# EAGLE design OSSIBeacon (EAGLE 6.1)

## Sheet 1 of 2
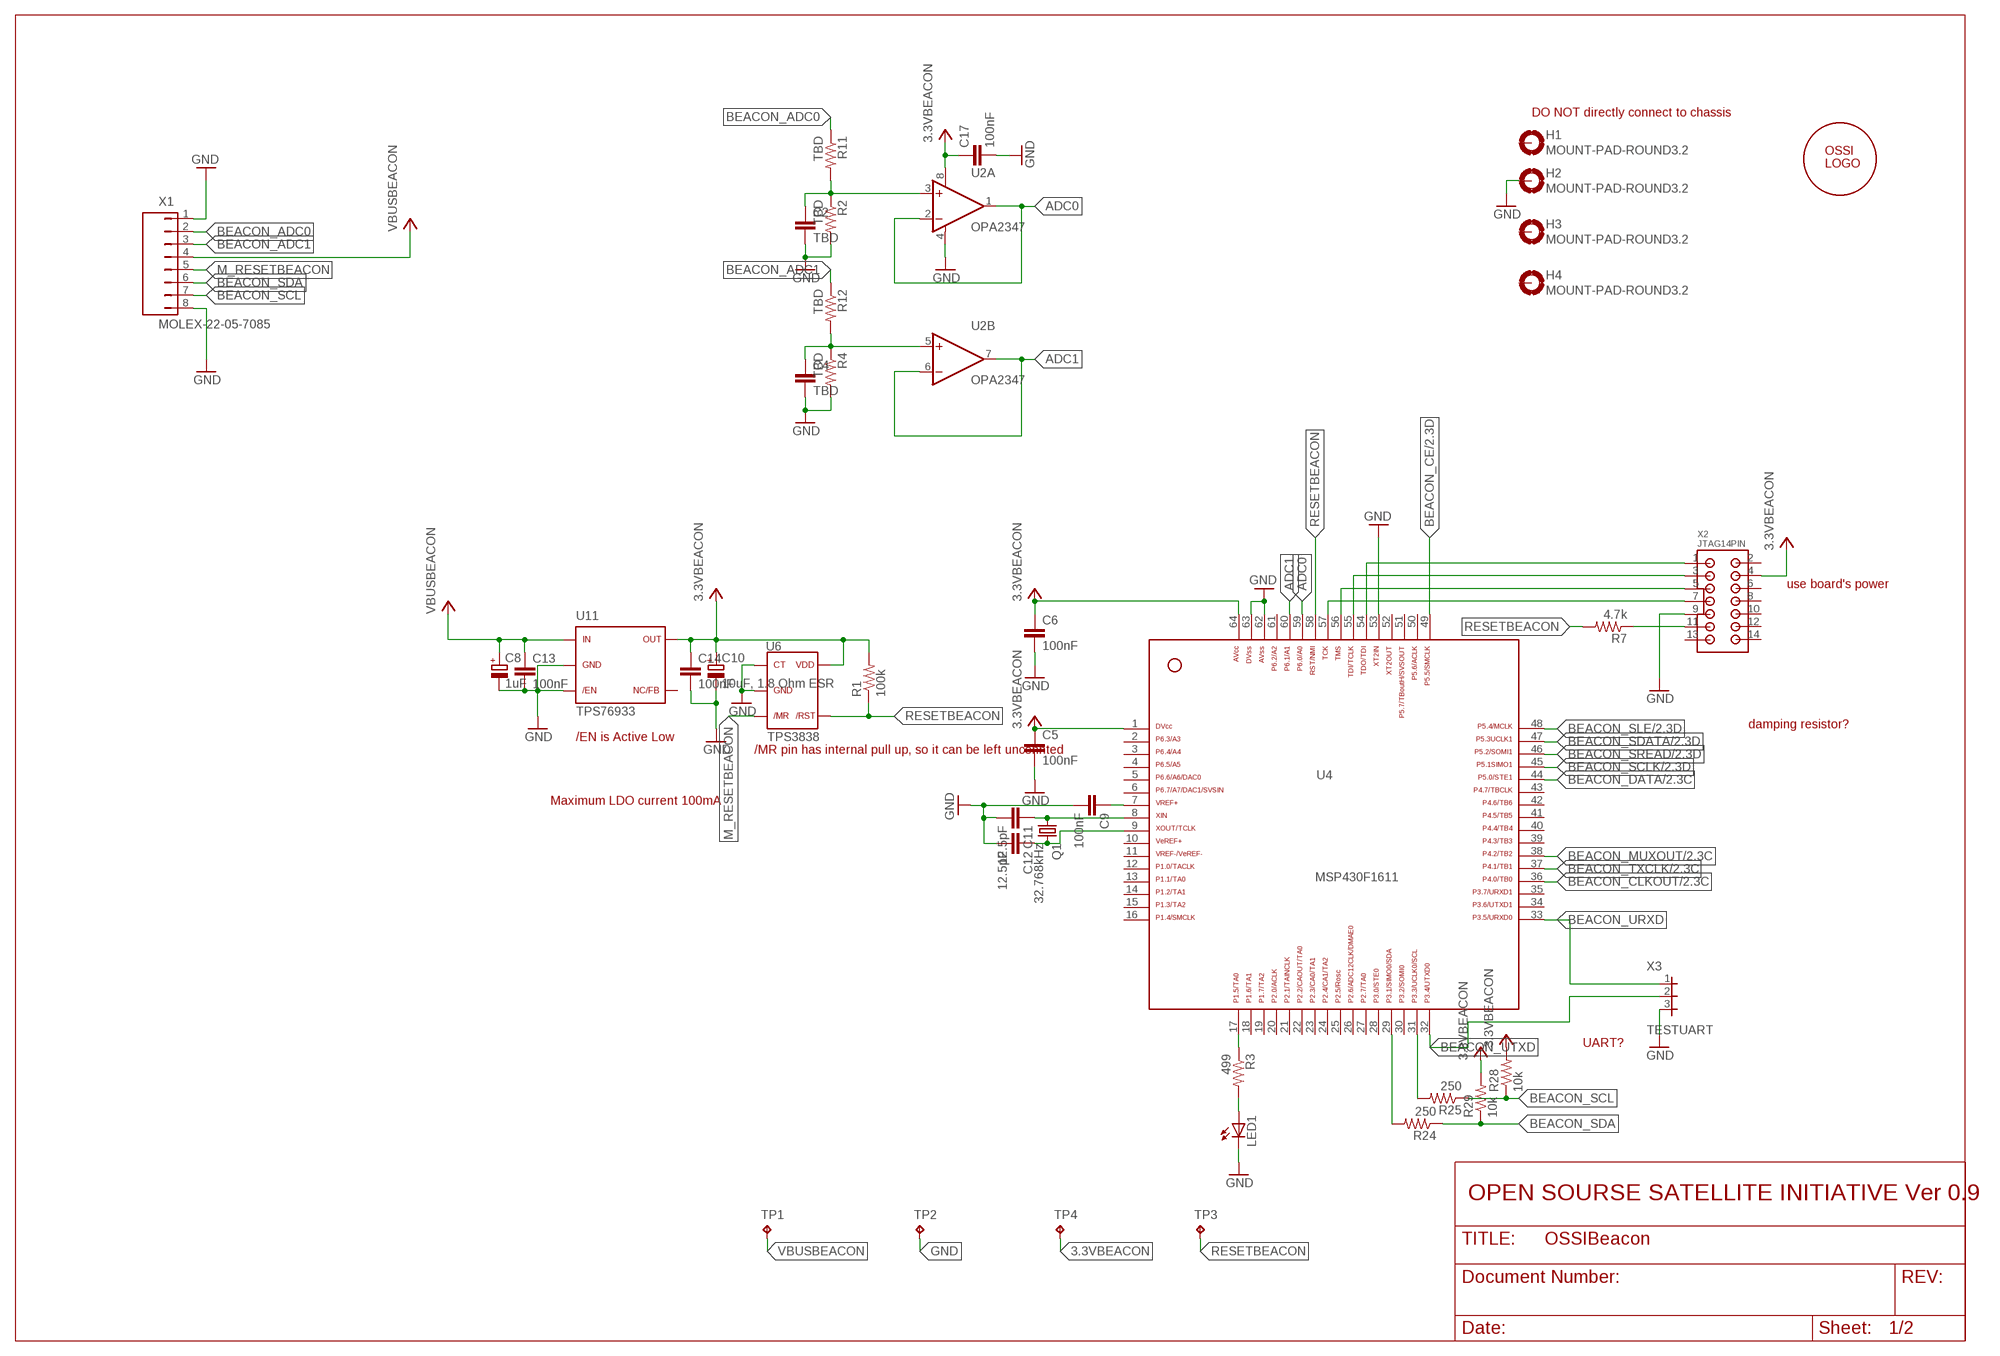
[diagram p0: schematic, sheet 1]

### Parts
C2  TBD  C0603(1608)  [C0603(1608)]
C4  TBD  C0603(1608)  [C0603(1608)]
C5  100nF  C0603(1608)  [C0603(1608)]
C6  100nF  C0603(1608)  [C0603(1608)]
C8  1uF  C-TANTAL-A  [C1206(3216)-A]
C9  100nF  C0603(1608)  [C0603(1608)]
C10  10uF, 1.8 Ohm ESR  C-TANTAL-C  [C2312(6032)-C]
C11  12.5pF  C0603(1608)  [C0603(1608)]
C12  12.5pF  C0603(1608)  [C0603(1608)]
C13  100nF  C0603(1608)  [C0603(1608)]
C14  100nF  C0603(1608)  [C0603(1608)]
C17  100nF  C0603(1608)  [C0603(1608)]
H1  MOUNT-PAD-ROUND3.2  [3.2-PAD-ROUND]
H2  MOUNT-PAD-ROUND3.2  [3.2-PAD-ROUND]
H3  MOUNT-PAD-ROUND3.2  [3.2-PAD-ROUND]
H4  MOUNT-PAD-ROUND3.2  [3.2-PAD-ROUND]
LED1  LED3MM  [LED3MM]
Q1  32.768kHz  NX-3215  [NX-3215]
R1  100k  R0603(1608)  [R0603(1608)]
R2  TBD  R0603(1608)  [R0603(1608)]
R3  499  R0603(1608)  [R0603(1608)]
R4  TBD  R0603(1608)  [R0603(1608)]
R7  4.7k  R0603(1608)  [R0603(1608)]
R11  TBD  R0603(1608)  [R0603(1608)]
R12  TBD  R0603(1608)  [R0603(1608)]
R24  250  R0603(1608)  [R0603(1608)]
R25  250  R0603(1608)  [R0603(1608)]
R28  10k  R0603(1608)  [R0603(1608)]
R29  10k  R0603(1608)  [R0603(1608)]
TP1  TP  [TP-13]
TP2  TP  [TP-13]
TP3  TP  [TP-13]
TP4  TP  [TP-13]
U2  OPA2347  [SOT23-8DCN]
U4  MSP430F1611  [PM/PAG64]
U6  TPS3838  [SOT23-5DBV]
U11  TPS76933  [SOT23-5DBV]
U$1  OSSILOGO-10  [OSSILOGO1010]
X1  MOLEX-22-05-7085  [22-05-7085]
X2  JTAG14PIN  [2514-6002UB]
X3  TESTUART  [TESTUART]

### Nets
3.3VBEACON: C5.1 C6.1 C10.1(+) C14.1 C17.1 R1.2 R28.2 R29.2 TP4.TP U2.8(A:V+) U4.1 U4.64 U6.5 U11.5 X2.4 ; also sheet 2
ADC0: U2.1(A:OUT) U2.2(A:-IN) U4.59
ADC1: U2.6(B:-IN) U2.7(B:OUT) U4.60
BEACON_ADC0: R11.1 X1.2
BEACON_ADC1: R12.1 X1.3
BEACON_CE: U4.49 ; also sheet 2
BEACON_CLKOUT: U4.36 ; also sheet 2
BEACON_DATA: U4.44 ; also sheet 2
BEACON_MUXOUT: U4.38 ; also sheet 2
BEACON_SCL: R25.1 R28.1 X1.7
BEACON_SCLK: U4.45 ; also sheet 2
BEACON_SDA: R24.1 R29.1 X1.6
BEACON_SDATA: U4.47 ; also sheet 2
BEACON_SLE: U4.48 ; also sheet 2
BEACON_SREAD: U4.46 ; also sheet 2
BEACON_TXCLK: U4.37 ; also sheet 2
BEACON_URXD: U4.33 X3.1
BEACON_UTXD: U4.32 X3.2
GND: C2.2 C4.2 C5.2 C6.2 C8.2(-) C9.2 C10.2(-) C11.2 C12.2 C13.2 C14.2 C17.2 H2.B3,2(MOUNT) LED1.K(C) R2.2 R4.2 TP2.TP U2.4(A:V-) U4.53 U4.62 U4.63 U6.1 U6.2 U11.2 U11.3 X1.1 X1.8 X2.9 X3.3 ; also sheet 2
M_RESETBEACON: U6.3 X1.5
N$1: LED1.A R3.2
N$2: R3.1 U4.17
N$3: C4.1 R4.1 R12.2 U2.5(B:+IN)
N$6: C2.1 R2.1 R11.2 U2.3(A:+IN)
N$7: C11.1 Q1.1 U4.8
N$8: C12.1 Q1.2 U4.9
N$11: U4.54 X2.1
N$12: C9.1 U4.7
N$14: U4.55 X2.3
N$15: U4.56 X2.5
N$16: U4.57 X2.7
N$21: R7.1 X2.11
N$58: R24.2 U4.29
N$59: R25.2 U4.31
RESETBEACON: R1.1 R7.2 TP3.TP U4.58 U6.4
VBUSBEACON: C8.1(+) C13.1 TP1.TP U11.1 X1.4
Unconnected: H1.B3,2(MOUNT) H3.B3,2(MOUNT) H4.B3,2(MOUNT) U4.2 U4.3 U4.4 U4.5 U4.6 U4.10 U4.11 U4.12 U4.13 U4.14 U4.15 U4.16 U4.18 U4.19 U4.20 U4.21 U4.22 U4.23 U4.24 U4.25 U4.26 U4.27 U4.28 U4.30 U4.34 U4.35 U4.39 U4.40 U4.41 U4.42 U4.43 U4.50 U4.51 U4.52 U4.61 U11.4 X2.2 X2.6 X2.8 X2.10 X2.12 X2.13 X2.14

### Notes on the sheet
- DO NOT directly connect to chassis
- use board's power
- damping resistor?
- /EN is Active Low
- /MR pin has internal pull up, so it can be left unconnted
- Maximum LDO current 100mA
- UART?
- OPEN SOURSE SATELLITE INITIATIVE Ver 0.9

## Sheet 2 of 2
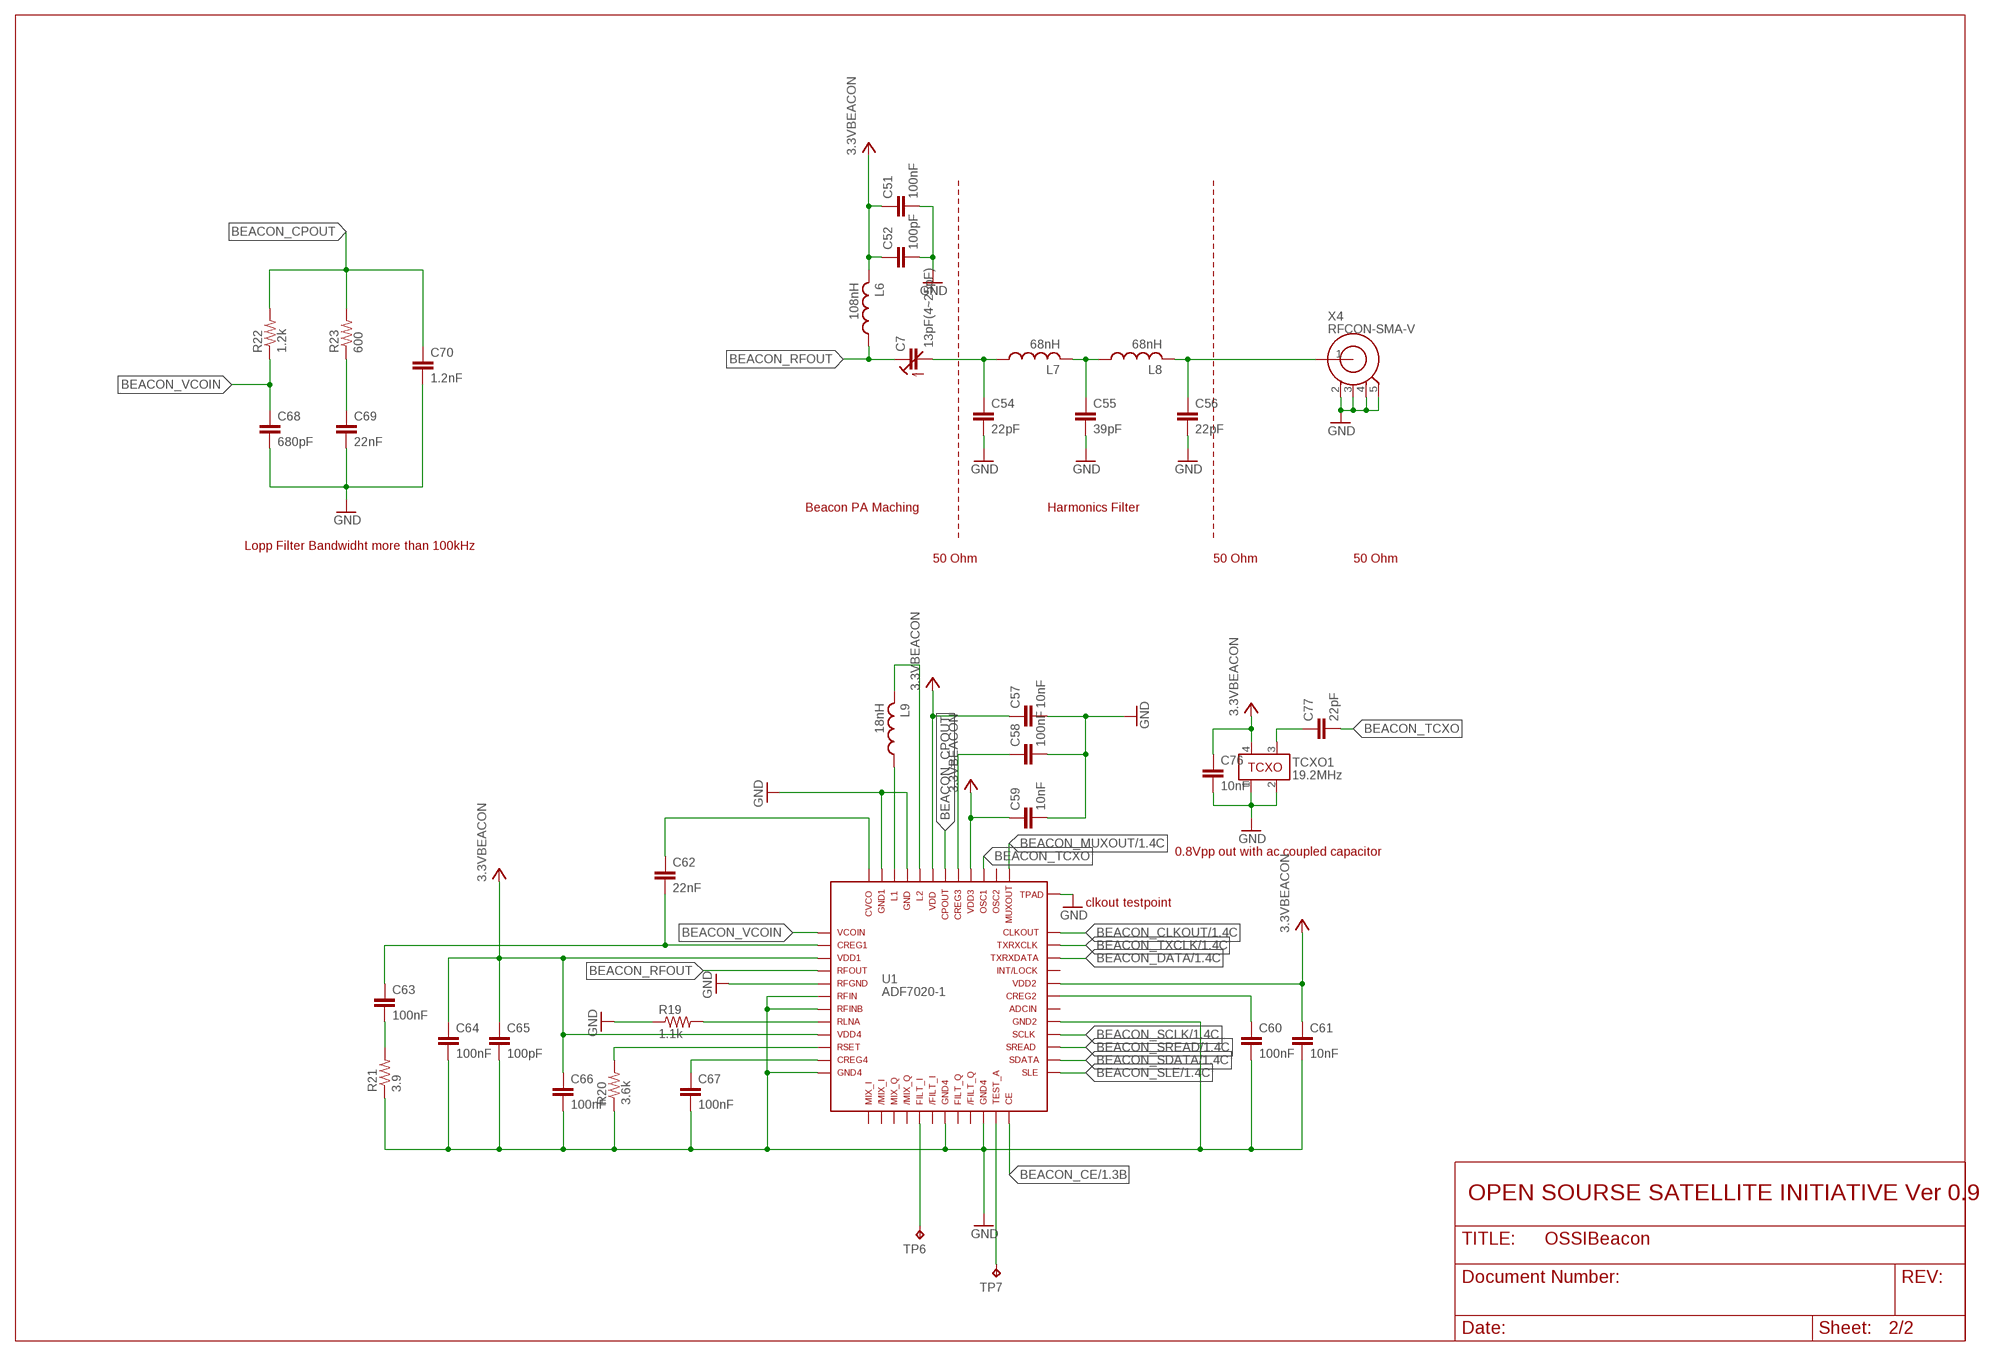
[diagram p1: schematic, sheet 2]

### Parts
C7  13pF(4~25pF)  C-TRIMM  [TZB4Z250BA10R00]
C51  100nF  C0603(1608)  [C0603(1608)]
C52  100pF  C0603(1608)  [C0603(1608)]
C54  22pF  C0603(1608)  [C0603(1608)]
C55  39pF  C0603(1608)  [C0603(1608)]
C56  22pF  C0603(1608)  [C0603(1608)]
C57  10nF  C0603(1608)  [C0603(1608)]
C58  100nF  C0603(1608)  [C0603(1608)]
C59  10nF  C0603(1608)  [C0603(1608)]
C60  100nF  C0603(1608)  [C0603(1608)]
C61  10nF  C0603(1608)  [C0603(1608)]
C62  22nF  C0603(1608)  [C0603(1608)]
C63  100nF  C0603(1608)  [C0603(1608)]
C64  100nF  C0603(1608)  [C0603(1608)]
C65  100pF  C0603(1608)  [C0603(1608)]
C66  100nF  C0603(1608)  [C0603(1608)]
C67  100nF  C0603(1608)  [C0603(1608)]
C68  680pF  C0603(1608)  [C0603(1608)]
C69  22nF  C0603(1608)  [C0603(1608)]
C70  1.2nF  C0603(1608)  [C0603(1608)]
C76  10nF  C0603(1608)  [C0603(1608)]
C77  22pF  C0603(1608)  [C0603(1608)]
L6  108nH  L0603(1608)  [L0603(1608)]
L7  68nH  L0603(1608)  [L0603(1608)]
L8  68nH  L0603(1608)  [L0603(1608)]
L9  18nH  L0603(1608)  [L0603(1608)]
R19  1.1k  R0603(1608)  [R0603(1608)]
R20  3.6k  R0603(1608)  [R0603(1608)]
R21  3.9  R0603(1608)  [R0603(1608)]
R22  1.2k  R0603(1608)  [R0603(1608)]
R23  600  R0603(1608)  [R0603(1608)]
TCXO1  19.2MHz  TCXO-M532  [TCXO_M532]
TP6  TP  [TP-13]
TP7  TP  [TP-13]
U1  ADF7020-1  [LFCSP48]
X4  RFCON-SMA-V  [SMA-V]

### Nets
3.3VBEACON: C51.1 C52.1 C57.1 C59.1 C61.1 C64.1 C65.1 C66.1 C76.1 L6.2 TCXO1.4 U1.3 U1.9 U1.32 U1.40 U1.43 ; also sheet 1
BEACON_CE: U1.24 ; also sheet 1
BEACON_CLKOUT: U1.36 ; also sheet 1
BEACON_CPOUT: C70.1 R22.2 R23.2 U1.42
BEACON_DATA: U1.34 ; also sheet 1
BEACON_MUXOUT: U1.37 ; also sheet 1
BEACON_RFOUT: C7.+(E) L6.1 U1.4
BEACON_SCLK: U1.28 ; also sheet 1
BEACON_SDATA: U1.26 ; also sheet 1
BEACON_SLE: U1.25 ; also sheet 1
BEACON_SREAD: U1.27 ; also sheet 1
BEACON_TCXO: C77.2 U1.39
BEACON_TXCLK: U1.35 ; also sheet 1
BEACON_VCOIN: C68.1 R22.1 U1.1
GND: C51.2 C52.2 C54.2 C55.2 C56.2 C57.2 C58.2 C59.2 C60.2 C61.2 C64.2 C65.2 C66.2 C67.2 C68.2 C69.2 C70.2 C76.2 R19.1 R20.1 R21.1 TCXO1.1 TCXO1.2 U1.5 U1.6 U1.7 U1.12 U1.19 U1.22 U1.29 U1.45 U1.47 U1.EXP X4.2 X4.3 X4.4 X4.5 ; also sheet 1
N$19: TP6.TP U1.17
N$23: TP7.TP U1.23
N$42: C7.-(A) C54.1 L7.1
N$43: C55.1 L7.2 L8.1
N$44: C56.1 L8.2 X4.1
N$45: C62.1 U1.48
N$46: C63.2 R21.2
N$47: C60.1 U1.31
N$48: C67.1 U1.11
N$49: R20.2 U1.10
N$50: R19.2 U1.8
N$51: C58.1 U1.41
N$52: C62.2 C63.1 U1.2
N$53: C69.1 R23.1
N$54: L9.1 U1.46
N$55: L9.2 U1.44
N$69: C77.1 TCXO1.3
Unconnected: U1.13 U1.14 U1.15 U1.16 U1.18 U1.20 U1.21 U1.30 U1.33 U1.38

### Notes on the sheet
- Beacon PA Maching | Harmonics Filter
- Lopp Filter Bandwidht more than 100kHz
- 50 Ohm | 50 Ohm | 50 Ohm
- 0.8Vpp out with ac coupled capacitor
- clkout testpoint
- OPEN SOURSE SATELLITE INITIATIVE Ver 0.9

## Library data of the parts
C2 C4-C6 C9 C11-C14 C17 C51 C52 C54-C70 C76 C77 = OSSI:C
C7 = OSSI:C-TRIMM
C8 = OSSI:C-TANTAL-A: TAJA105M020RNJ Tantal Capacitor Manufacturer: AVX 1206(3126) Ref: www.avx.com/docs/techinfo/tantappl.pdf
C10 = OSSI:C-TANTAL-C: THJC106M025RJN Taltal Capacitor manufacture: AVX 2312(6032)
H1-H4 = OSSI:MOUNT-PAD-ROUND
L6-L9 = OSSI:L
LED1 = led:LED: LED OSRAM: - CHIPLED LG R971, LG N971, LY N971, LG Q971, LY Q971, LO R971, LY R971 LH N974, LH R974 LS Q976, LO Q976, LY Q976 LO Q996 - Hyper CHIPLED LW Q18S LB Q993, LB Q99A, LB R99A - SideLED LS A670, LO A670, LY A670, LG A670, LP A670 LB A673, LV A673, LT A673, LW A673 LH A674 LY A675 LS A676, LA A676, LO A676, LY A676, LW A676 LS A679, LY A679, LG A679 - Hyper Micro SIDELED® LS Y876, LA Y876, LO Y876, LY Y876 LT Y87S - SmartLED LW L88C, LW L88S LB L89C, LB L89S, LG L890 LS L89K, LO L89K, LY L89K LS L896, LA L896, LO L896, LY L896 - TOPLED LS T670, LO T670, LY T670, LG T670, LP T670 LSG T670, LSP T670, LSY T670, LOP T670, LYG T670 LG T671, LOG T671, LSG T671 LB T673, LV T673, LT T673, LW T673 LH T674 LS T676, LA T676, LO T676, LY T676, LB T676, LH T676, LSB T676, LW T676 LB T67C, LV T67C, LT T67C, LS T67K, LO T67K, LY T67K, LW E67C LS E67B, LA E67B, LO E67B, LY E67B, LB E67C, LV E67C, LT E67C LW T67C LS T679, LY T679, LG T679 LS T770, LO T770, LY T770, LG T770, LP T770 LB T773, LV T773, LT T773, LW T773 LH T774 LS E675, LA E675, LY E675, LS T675 LS T776, LA T776, LO T776, LY T776, LB T776 LHGB T686 LT T68C, LB T68C - Hyper Mini TOPLED® LB M676 - Mini TOPLED Santana® LG M470 LS M47K, LO M47K, LY M47K Source: http://www.osram.convergy.de LUXEON: - LUMILED® LXK2-PW12-R00, LXK2-PW12-S00, LXK2-PW14-U00, LXK2-PW14-V00 LXK2-PM12-R00, LXK2-PM12-S00, LXK2-PM14-U00 LXK2-PE12-Q00, LXK2-PE12-R00, LXK2-PE12-S00, LXK2-PE14-T00, LXK2-PE14-U00 LXK2-PB12-K00, LXK2-PB12-L00, LXK2-PB12-M00, LXK2-PB14-N00, LXK2-PB14-P00, LXK2-PB14-Q00 LXK2-PR12-L00, LXK2-PR12-M00, LXK2-PR14-Q00, LXK2-PR14-R00 LXK2-PD12-Q00, LXK2-PD12-R00, LXK2-PD12-S00 LXK2-PH12-R00, LXK2-PH12-S00 LXK2-PL12-P00, LXK2-PL12-Q00, LXK2-PL12-R00 Source: www.luxeon.com KINGBRIGHT: KA-3528ASYC Source: www.kingbright.com
Q1 = OSSI:NX-3215: NDK 32.768 kHz SMD Crystal P/N: NX3215SA-32.768K-STD-MUA-9 Nominal frequency (kHz): 32.768 Package Size (L×W×H : mm): 3.2×1.5×0.8 Operating Temperature Range(*1) / Storage Temperature Range (°C): -40 to +85 / -40 to +85 Level of drive: 0.1µW (Max. 0.5µW) Frequency Tolerance (25±3°C): ±20×10-6 Load Capacitance: 9.0pF, 12.5pF Equivalent Series Resistance: 70kΩ Max. Ordering Code: NX3215SA-32.768K-STD-MUA-9 (Load Capacitance9.0pF) /NX3215SA-32.768K-STD-MUA-8 (Load Capacitance12.5pF)
R1-R4 R7 R11 R12 R19-R25 R28 R29 = OSSI:R
TCXO1 = OSSI:TCXO-M532: 532L25DT19M2000: CTO electronic components Model 532 19.2MHz TCXO for RF transeiver Clipped Sine Wave Output Operating Voltage, +3.3Vdc Operating Temperature to -30°C to +85°C Frequency Stability: ±2.5ppm
TP1-TP4 TP6 TP7 = OSSI:TP
U1 = OSSI:ADF7020-1: ADF7020-1 RF transceiver by analog device
U2 = OSSI:OPA2347: OPA2347 RAIL-TO-RAIL INPUT AND OUTPUT SINGLE SUPPLY: 2.3V to 5.5V LOW IQ: 20µ
U4 = OSSI:MSP430F1611: MSP430F1611
U6 = OSSI:TPS3838: TPS3838 NanoPower Supervisory IC from texas instruments. TPS3838 is open-drain output
U11 = OSSI:TPS769*: TPS769XX series LDO 100mA / 70mV drop out
U$1 = OSSI:OSSILOGO
X1 = OSSI:MOLEX-22-05-7085
X2 = OSSI:JTAG14PIN: JTAG 14 Pin Connector
X3 = OSSI:TESTUART
X4 = OSSI:RFCON: RF Connectors

## Board
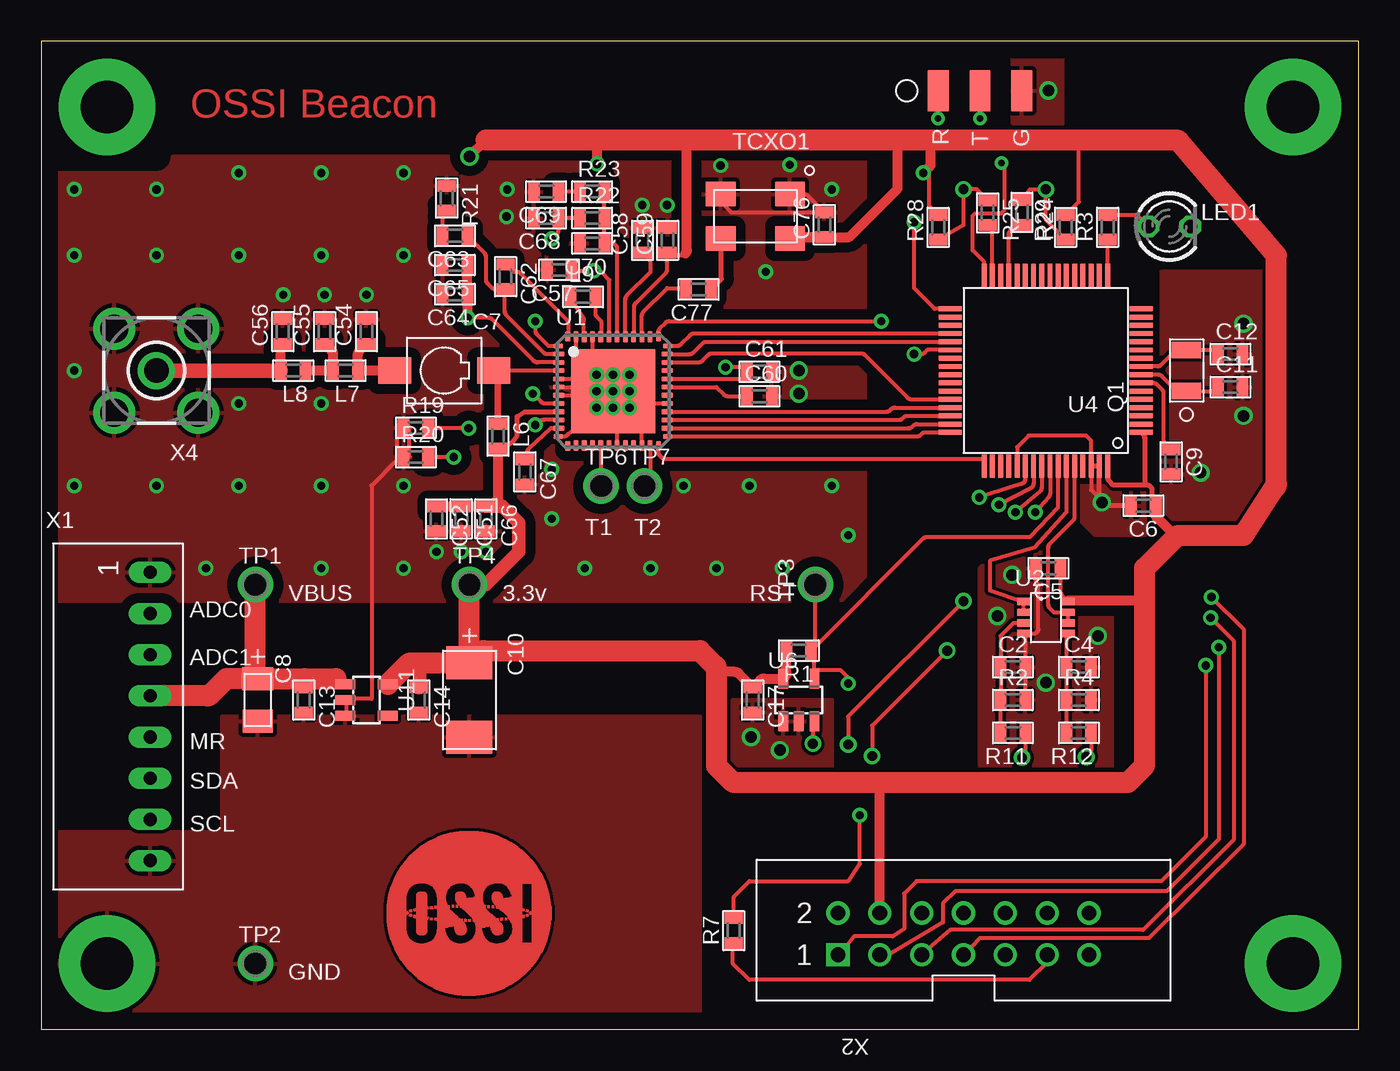
[diagram p2: board, top side]
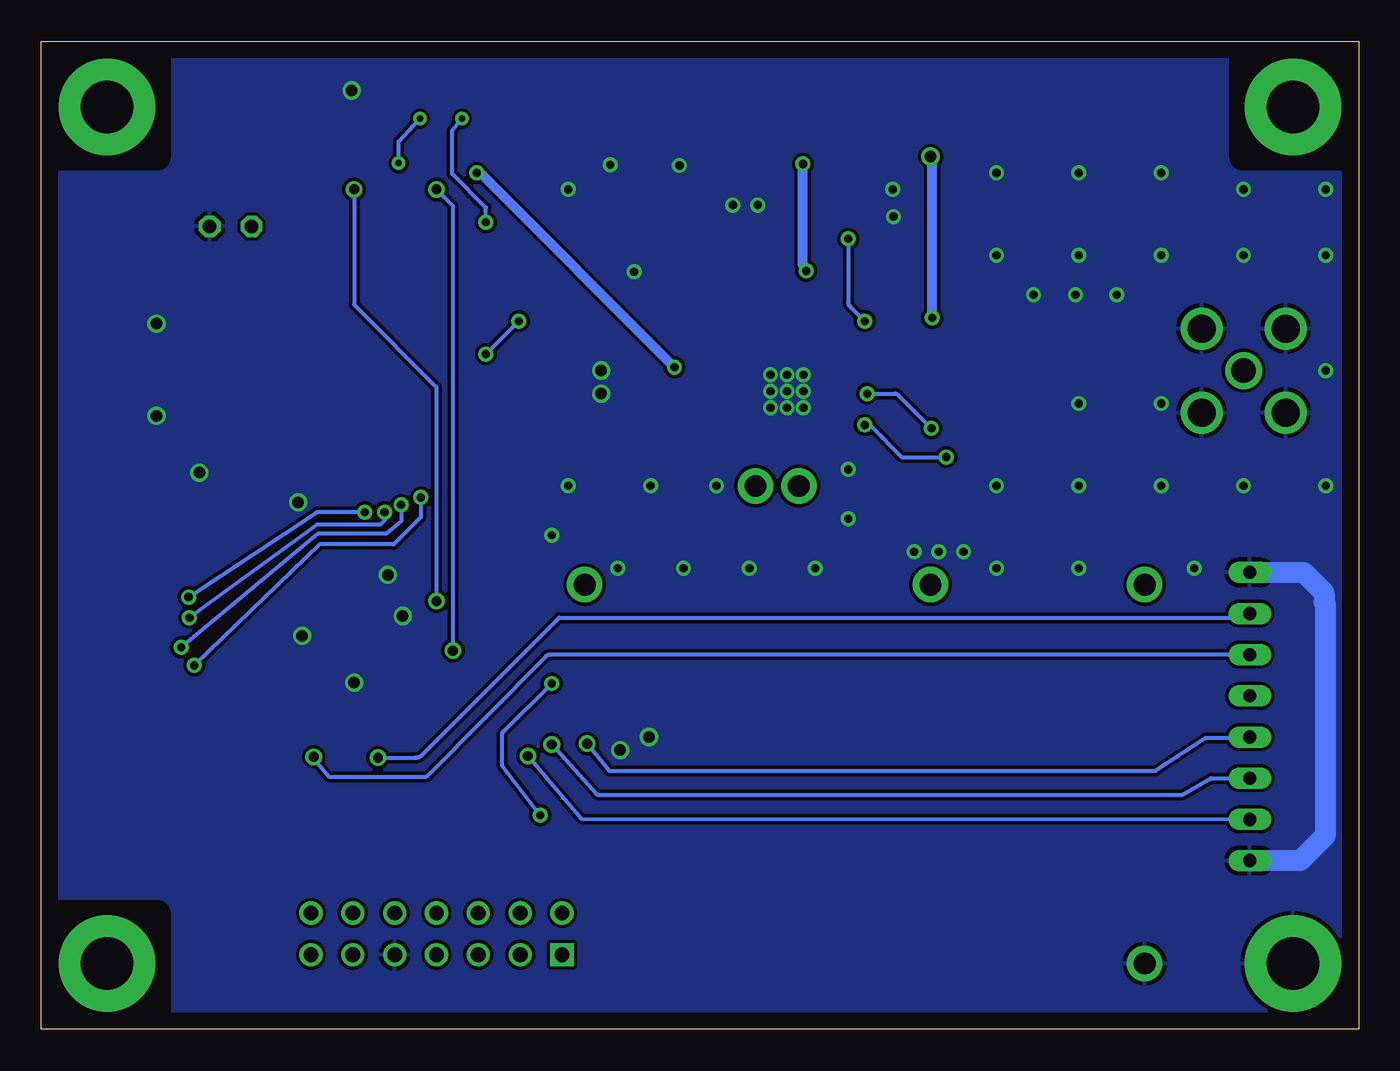
[diagram p3: board, bottom side, seen from below]

Size 80 x 60 mm. Coordinates in mm from the lower left corner, seen from the top.
Outline: 0,60 0,0 80,0 80,60 0,60
Copper layers (1*16): Top 0.035mm / dielectric 1.5mm / Bottom 0.035mm
Design rules: minimum track width 10mil, minimum drill 15mil, track to track 8mil, track to pad 6mil, pad to pad 6mil, via to via 6mil, smd to smd 6mil, copper to edge 40mil, drill to drill 8mil, minimum pad ring 10mil, minimum via ring 8mil, stop-mask expansion 4mil, vias tented up to drill 0mil, thermal gap 10mil

### Footprints (pad centres in the part's own frame; a part is rotated, then mirrored left to right if it is on the bottom)
C0603(1608) = smd 0.7 x 1.1: 1 -0.75,0; 2 0.75,0
TZB4Z250BA10R00 = smd 2 x 1.6: + -3,0; - 3,0
C1206(3216)-A = smd 1.4 x 1.9: 1 -1.3,0 | smd 1.4 x 1.8: 2 1.3,0
C2312(6032)-C = smd 2 x 2.8: 1 -2.25,0; 2 2.25,0
3.2-PAD-ROUND = drill 3.2 pad 5.842: B3,2 0,0
L0603(1608) = smd 0.7 x 1.1: 1 -0.75,0; 2 0.75,0
LED3MM = drill 0.813 octagon: A -1.27,0; K 1.27,0
NX-3215 = smd 1 x 1.8: 1 -1.25,0; 2 1.25,0
R0603(1608) = smd 0.7 x 1.1: 1 -0.75,0; 2 0.75,0
TCXO_M532 = smd 1.8 x 1.5: 1 -2.1,-1.35; 2 2.1,-1.35; 3 2.1,1.35; 4 -2.1,1.35
TP-13 = drill 1.321 pad 2.159: TP 0,0
LFCSP48 = smd 0.6 x 0.32: 1 -3.325,2.75; 12 -3.325,-2.75; 25 3.325,-2.75; 36 3.325,2.75 | smd 0.7 x 0.32: 2 -3.3,2.25; 3 -3.3,1.75; 4 -3.3,1.25; 5 -3.3,0.75; 6 -3.3,0.25; 7 -3.3,-0.25; 8 -3.3,-0.75; 9 -3.3,-1.25; 10 -3.3,-1.75; 11 -3.3,-2.25; 26 3.3,-2.25; 27 3.3,-1.75; 28 3.3,-1.25; 29 3.3,-0.75; 30 3.3,-0.25; 31 3.3,0.25; 32 3.3,0.75; 33 3.3,1.25; 34 3.3,1.75; 35 3.3,2.25 | smd 0.32 x 0.6: 13 -2.75,-3.325; 24 2.75,-3.325; 37 2.75,3.325; 48 -2.75,3.325 | smd 0.32 x 0.7: 14 -2.25,-3.3; 15 -1.75,-3.3; 16 -1.25,-3.3; 17 -0.75,-3.3; 18 -0.25,-3.3; 19 0.25,-3.3; 20 0.75,-3.3; 21 1.25,-3.3; 22 1.75,-3.3; 23 2.25,-3.3; 38 2.25,3.3; 39 1.75,3.3; 40 1.25,3.3; 41 0.75,3.3; 42 0.25,3.3; 43 -0.25,3.3; 44 -0.75,3.3; 45 -1.25,3.3; 46 -1.75,3.3; 47 -2.25,3.3 | smd 5.1 x 5.1: EXP 0,0
SOT23-8DCN = smd 0.45 x 0.8: 1 -0.975,-1.35; 2 -0.325,-1.35; 3 0.325,-1.35; 4 0.975,-1.35; 5 0.975,1.35; 6 0.325,1.35; 7 -0.325,1.35; 8 -0.975,1.35
PM/PAG64 = smd 1.4 x 0.3: 1 -5.8,3.75; 2 -5.8,3.25; 3 -5.8,2.75; 4 -5.8,2.25; 5 -5.8,1.75; 6 -5.8,1.25; 7 -5.8,0.75; 8 -5.8,0.25; 9 -5.8,-0.25; 10 -5.8,-0.75; 11 -5.8,-1.25; 12 -5.8,-1.75; 13 -5.8,-2.25; 14 -5.8,-2.75; 15 -5.8,-3.25; 16 -5.8,-3.75; 33 5.8,-3.75; 34 5.8,-3.25; 35 5.8,-2.75; 36 5.8,-2.25; 37 5.8,-1.75; 38 5.8,-1.25; 39 5.8,-0.75; 40 5.8,-0.25; 41 5.8,0.25; 42 5.8,0.75; 43 5.8,1.25; 44 5.8,1.75; 45 5.8,2.25; 46 5.8,2.75; 47 5.8,3.25; 48 5.8,3.75 | smd 0.3 x 1.4: 17 -3.75,-5.8; 18 -3.25,-5.8; 19 -2.75,-5.8; 20 -2.25,-5.8; 21 -1.75,-5.8; 22 -1.25,-5.8; 23 -0.75,-5.8; 24 -0.25,-5.8; 25 0.25,-5.8; 26 0.75,-5.8; 27 1.25,-5.8; 28 1.75,-5.8; 29 2.25,-5.8; 30 2.75,-5.8; 31 3.25,-5.8; 32 3.75,-5.8; 49 3.75,5.8; 50 3.25,5.8; 51 2.75,5.8; 52 2.25,5.8; 53 1.75,5.8; 54 1.25,5.8; 55 0.75,5.8; 56 0.25,5.8; 57 -0.25,5.8; 58 -0.75,5.8; 59 -1.25,5.8; 60 -1.75,5.8; 61 -2.25,5.8; 62 -2.75,5.8; 63 -3.25,5.8; 64 -3.75,5.8
SOT23-5DBV = smd 0.6 x 1.22: 1 -0.95,-1.3; 2 0,-1.3; 3 0.95,-1.3; 4 0.95,1.3; 5 -0.95,1.3
22-05-7085 = drill 0.8 long: 1 -8.75,0; 2 -6.25,0; 3 -3.75,0; 4 -1.25,0; 5 1.25,0; 6 3.75,0; 7 6.25,0; 8 8.75,0
2514-6002UB = drill 0.9 square: 1 -1.27,7.62 | drill 0.9: 2 1.27,7.62; 3 -1.27,5.08; 4 1.27,5.08; 5 -1.27,2.54; 6 1.27,2.54; 7 -1.27,0; 8 1.27,0; 9 -1.27,-2.54; 10 1.27,-2.54; 11 -1.27,-5.08; 12 1.27,-5.08; 13 -1.27,-7.62; 14 1.27,-7.62
TESTUART = smd 1.27 x 2.5: 1 -2.54,0; 2 0,0; 3 2.54,0
SMA-V = drill 1.5: 1 0,0 | drill 1.7: 2 -2.55,2.55; 3 2.55,2.55; 4 2.55,-2.55; 5 -2.55,-2.55

### Placement (x,y rotation side)
C2  59,22 0 top
C4  63,22 0 top
C5  61.15,28 180 top
C6  66.92,31.8 180 top
C7  24.46,40 180 top
C8  13.15,20 270 top
C9  68.6,34.46 270 top
C10  26,20 270 top
C11  72.2,39 0 top
C12  72.2,41 0 top
C13  15.94,20 270 top
C14  22.93,20 270 top
C17  43.2,20 270 top
C51  25.5,31 270 top
C52  24,31 270 top
C54  19.75,42.37 90 top
C55  17.21,42.37 90 top
C56  14.67,42.37 90 top
C57  31.45,46.12 180 top
C58  36.51,47.91 90 top
C59  38.03,47.91 90 top
C60  43.61,38.44 0 top
C61  43.61,39.93 0 top
C62  28.2,45.7 270 top
C63  25.12,48.18 180 top
C64  25.12,44.64 180 top
C65  25.12,46.41 180 top
C66  27,31 270 top
C67  29.37,33.84 270 top
C68  30.66,49.26 180 top
C69  30.66,50.87 180 top
C70  33.45,47.72 180 top
C76  47.55,48.85 90 top
C77  39.91,44.93 180 top
H1  4,56 0 top
H2  4,4 0 top
H3  76,4 0 top
H4  76,56 0 top
L6  27.73,36.02 270 top
L7  18.48,40 180 top
L8  15.3,40 180 top
L9  32.9,44.48 0 top
LED1  68.5,48.75 0 top
Q1  69.54,40 90 top
R1  46,23 180 top
R2  59,20 0 top
R3  64.75,48.7 90 top
R4  63,20 0 top
R7  42.05,6 90 top
R11  59,18 180 top
R12  63,18 180 top
R19  22.75,36.52 0 top
R20  22.75,34.75 0 top
R21  24.62,50.47 270 top
R22  33.45,49.26 0 top
R23  33.45,50.87 0 top
R24  59.55,49.6 270 top
R25  57.46,49.58 270 top
R28  54.46,48.7 90 top
R29  62.2,48.7 90 top
TCXO1  43.36,49.37 180 top
TP1  13,27 0 top
TP2  13,4 0 top
TP3  47,27 90 top
TP4  26,27 0 top
TP6  34,33 0 top
TP7  36.62,33 0 top
U1  34.72,38.75 0 top
U2  61,25 270 top
U4  61,40 180 top
U6  46,20 0 top
U11  19.75,20 270 top
U$1  26,7.05 0 top
X1  6.62,19 270 top
X2  56,5.79 90 top
X3  57,57 0 top
X4  7,40 180 top

### Tracks (layer width: path | path; a pad name or v marks a point on that pad's centre or on a via)
3.3VBEACON  (via drill 0.5, 0.7)
  Top 0.254: 45.68,48.1 arc45 TCXO1.4 | U1.32 42.7,39.5 42.85,39.65 42.85,39.88 | 42.85,39.88 42.85,39.95 | U1.3 30.14,40.5 arc-45 29.92,40.59 arc-45 29.9,40.6 27.39,43.11 arc45 27.17,43.2 v25.9,43.2 | U2.8 61.99,26.33 arc-45 61.9,26.66 C5.1 | v41.55,40.2 42.59,40.2 C61.1 42.93,39.88 42.85,39.88 | 27.75,35.2 arc-45 27.73,35.24 L6.2 | U1.40 arc45 36,42.12 36,43.87 arc-45 36.09,44.09 37.91,45.91 arc45 38,46.13 38,47 arc45 38.03,47.07 C59.1 38.1,47.09 arc45 38.32,47 39,47 39.11,47.11 | C57.1 arc45 32.36,46.05 v33.55,46.05 33.82,46.05 arc-45 34.04,45.96 34.5,45.5 34.5,42.12 arc-45 U1.43 | R29.2 63,50.25 63,54 | R28.2 53.92,49.98 53.92,52.38 | 39.37,54 39.37,54.1 39.2,54.05
  Top 0.305: L6.2 28.07,35.3 28.65,35.7 28.9,36.05 28.9,37.2 29.35,37.5 U1.9 | U2.8 arc-45 62.36,26.05 | C6.1 67.54,31.93 arc-45 67.45,32.15 67.45,32.85 67.34,32.96 arc45 67.12,33.05 67,33.05 | 67,33.05 65.1,33.05 64.84,33.31 arc-45 64.75,33.53 U4.64 | U4.1 66.91,36.14 arc-45 67,35.92 67,33.05
  Top 0.61: C76.1 45.68,48.1 | C65.1 C64.1 25.87,43.27 arc45 v25.9,43.2 | 41,21.7 42.12,21.7 arc-45 42.34,21.61 C17.1 43.66,21.21 arc-45 43.88,21.3 U6.5 45.16,21.41 arc45 45.25,21.63 R1.2 | 62.36,26.05 67,26.05 | 68.91,29.91 67.76,31.05 arc-45 67.67,31.28 C6.1 | TCXO1.4 45.55,48.1 49.05,48.1 52,51.05 52,54 | v53.55,52 53.92,52.38 54,52.45 54,54 | C52.1 C51.1 C66.1 27.3,31.75 27.75,32.2 27.75,35.2 | 39.11,47.11 arc45 39.2,47.33 39.2,54.05 | v33.75,52.55 33.75,54 | v26,53 27,54 | X2.4 50.92,14.92 51,15
  Top 0.813: C14.1 arc45 23,20.93 23,22.25 | C66.1 28,31.75 28.93,30.82 arc-45 29,30.64 29,29 27.07,27.07 arc-45 26.89,27 TP4.TP
  Top 1.27: C10.1 TP4.TP | C10.1 26.66,22.91 arc-45 26.88,23 40,23 40.91,22.09 arc-45 41,21.87 41,21.7 41,16 41.91,15.09 arc45 42.13,15 51,15 66,15 66.91,15.91 arc45 67,16.13 67,26.05 67,28 68.91,29.91 arc-45 69.13,30 73,30 74.91,32.91 arc45 75,33.13 75,47 69.09,53.91 arc45 68.87,54 63,54 54,54 52,54 39.37,54 33.75,54 27,54 | U11.5 22.26,22.16 arc-45 22.48,22.25 23,22.25 C10.1
  Bottom 0.254: 53.35,52 v53.55,52 | v33.55,46.05 33.66,46.16 arc45 33.75,46.38
  Bottom 0.61: v41.55,40.2 53.35,52 | 33.75,46.38 v33.75,52.55 | v25.9,43.2 25.9,52.77 arc-45 v25.99,52.99 v26,53
ADC0
  Top 0.254: U4.59 62.25,31.4 60.3,29.25 57.6,28.45 57.6,26.65 59.65,25.95 U2.1 U2.2
ADC1
  Top 0.254: U2.6 U2.7 arc-45 62.29,25.3 61.5,25.3 61.24,25.56 arc-45 61.15,25.78 61.15,29.27 arc-45 61.24,29.49 62.66,30.91 arc45 62.75,31.13 U4.60
BEACON_ADC0  (via drill 0.6)
  Top 0.254: R11.1 59.75,16.83 arc-45 59.66,16.61 v59.55,16.5
  Bottom 0.254: v59.55,16.5 57.28,16.5 arc-45 56.96,16.59 48.55,25 7,25 arc-45 6.78,25.09 X1.2
BEACON_ADC1  (via drill 0.6)
  Top 0.254: R12.1 63.75,16.98 arc-45 63.66,16.76 v63.45,16.55
  Bottom 0.254: X1.3 49.12,22.75 arc-45 49.34,22.66 56.6,15.35 62.55,15.35 63.38,16.38 arc45 v63.45,16.55
BEACON_CE
  Top 0.254: U1.24 37.47,35.06 arc45 37.56,34.84 37.66,34.74 arc45 37.88,34.65 57.25,34.65 U4.49
BEACON_CLKOUT
  Top 0.254: 55.4,42.25 U4.36 39.63,42.25 arc45 39.41,42.16 38.84,41.59 arc-45 38.62,41.5 U1.36
BEACON_CPOUT
  Top 0.254: U1.42 34.97,47.4 arc45 34.88,47.62 34.75,47.75 34.27,47.75 arc45 C70.1 R22.2 R23.2
BEACON_DATA
  Top 0.254: U1.34 39.92,40.5 arc45 40.14,40.59 40.51,40.96 arc-45 40.73,41.05 49.77,41.05 arc-45 49.99,40.96 52.61,38.34 arc45 52.83,38.25 U4.44 55.4,38.25
BEACON_MUXOUT  (via drill 0.5)
  Top 0.254: U1.37 37.47,42.34 arc-45 37.56,42.56 37.91,42.91 arc-45 38.13,43 v51,43 | v53,41 53.42,41 arc45 53.64,41.09 53.8,41.25 U4.38
  Bottom 0.254: v51,43 v53,41
BEACON_RFOUT
  Top 0.254: U1.4 27.5,40
  Top 0.406: L6.1 27.73,39.63 arc45 27.64,39.86 27.5,40 C7.+
BEACON_SCL  (via drill 0.6)
  Top 0.254: R25.1 56.79,51 v56,51 56,48.84 R28.1 | v55,23 50.45,18.45 v50.45,16.6
  Bottom 0.254: v56,51 55,50 v55,23 | v50.45,16.6 47.2,12.8 X1.7
BEACON_SCLK
  Top 0.254: U1.28 51.32,37.5 arc45 51.54,37.59 51.61,37.66 arc-45 51.83,37.75 U4.45
BEACON_SDA  (via drill 0.6)
  Top 0.254: R24.1 60.05,51 v61,51 61,49.15 R29.1 | v56,26 49,19 v49,17.3
  Bottom 0.254: v61,51 61,44 56,39 v56,26 | v49,17.3 46.25,14.25 10.7,14.25 8.97,15.25 X1.6
BEACON_SDATA
  Top 0.254: U1.26 52.67,36.5 arc45 52.89,36.59 52.96,36.66 arc-45 53.18,36.75 U4.47 55.4,36.75
BEACON_SLE
  Top 0.254: U1.25 53.17,36 arc45 53.39,36.09 53.46,36.16 arc-45 53.68,36.25 U4.48 55.5,36.25
BEACON_SREAD
  Top 0.254: U1.27 52.07,37 arc45 52.29,37.09 52.36,37.16 arc-45 52.58,37.25 U4.46
BEACON_TCXO
  Top 0.254: U1.39 36.47,43.34 arc-45 36.56,43.56 38,45 39.03,45 | 39.03,45 arc-45 39.15,44.95 | C77.2 39.12,44.96 39.03,45
BEACON_TXCLK
  Top 0.254: U1.35 39.37,41 arc45 39.59,41.09 40.16,41.66 arc-45 40.38,41.75 U4.37
BEACON_URXD  (via drill 0.4, 0.5)
  Top 0.254: U4.33 54.25,43.75 53,45 v53,49 | v54.45,55.3 54.45,56.9 54.5,56.95 54.5,57 X3.1
  Bottom 0.254: v53,49 53,49.9 55.05,51.95 55.05,54.55 v54.45,55.3
BEACON_UTXD  (via drill 0.4)
  Top 0.254: U4.32 57.25,46.6 56.55,47.3 56.55,49.4 56.7,49.55 58.3,49.55 58.5,49.75 58.5,52.4 v58.3,52.6 | v57,55.3 X3.2
  Bottom 0.254: v58.3,52.6 58.3,53.9 v57,55.3
BEACON_VCOIN  (via drill 0.5)
  Top 0.254: R22.1 C68.1 31.41,48.54 arc-45 31.32,48.32 v31,48 | v30,43 30,42.43 arc45 30.09,42.21 30.8,41.5 U1.1
  Bottom 0.254: v31,48 31,44.13 arc-45 30.91,43.91 v30,43
GND  (via drill 0.5 pad 0.3, 0.7)
  Top 0.254: TCXO1.2 41.26,50.37 arc45 41.35,50.15 41.9,49.6 C76.2 arc45 C76.2 46.54,50.62 arc45 46.31,50.72 TCXO1.1 | U1.29 36.3,38 | 36.3,38 35.53,38 | 35.53,38 arc-45 35.31,38.09 34.73,38.67 | 34.73,38.67 34.7,38.7 | U1.22 36.47,37.7 arc45 36.38,37.92 36.3,38 | U1.7 33,38.5 | 33,38.5 34.32,38.5 arc45 34.54,38.59 34.7,38.75 34.23,39.23 | U1.45 33.47,40.11 arc45 33.56,39.89 34.04,39.41 | U1.47 32.47,39.16 arc45 32.56,38.94 33,38.5 | U1.12 31.72,36 arc45 31.99,36.14 33,37 33,38.5 | U1.5 33.82,39.5 arc-45 34.04,39.41 | 34.04,39.41 34.23,39.23 | U1.6 33.87,39 arc45 34.09,39.09 34.23,39.23 | U1.19 34.97,37.31 arc-45 35.06,37.53 35.53,38 | C5.2 60.25,27.58 arc45 60.34,27.36 60.55,26.95 60.55,24.28 arc-45 60.36,24.06 60.35,24.05 59.71,24.05 arc45 U2.4 U2.4 arc-45 59.75,23.79 C2.2 R2.2 | 64.75,31.8 64.7,31.8 63.75,32.75 U4.62 63.75,35.75 63.45,36.05 59.95,36.05 59.25,35.35 U4.53 | U11.3 18.54,19.05 18.54,19.81 U11.2 18.54,20.07 20.07,20.07 20.07,33.02 21.59,34.54 21.59,36.58 21.84,36.83 22.1,36.83 22.35,36.58 22.35,34.8 22.1,34.8 22.05,34.8 | 34.73,38.67 34.67,38.61 U1.EXP
  Top 0.305: C6.2 64.75,31.8 64.34,32.21 arc-45 64.25,32.43 U4.63 U4.62
  Bottom 1.27: X1.1 3.35,27.75 2.19,26.59 arc45 2.1,26.37 2.1,25.95 arc45 2.05,25.83 2.05,11.75 3.46,10.34 arc45 3.68,10.25 X1.8
  other vias: 34.72,38.75 33.72,39.75 34.72,39.75 35.72,39.75 35.72,38.75 33.72,38.75 33.72,37.75 34.72,37.75 35.72,37.75 43.1,17.75 58.95,27.6 58.05,25.1 61,21.05 73,42.85 73,37.25 70.4,33.8 64.4,32 46,40 46,38.6 45,28 41,28 37,28 33,28 31,31 39,33 43,33 48,33 49,30 31,34 27,29 24,29 22,28 17,28 10,28 2,51 7,51 12,52 17,52 22,52 2,47 7,47 12,47 17,47 22,47 12,33 17,33 22,33 7,33 2,33 2,40 17,38 12,38 38,50.05 41.25,52.45 48,51 44,46 45.45,52.5 14.7,44.6 17.2,44.6 19.75,44.6 25.5,29 44.85,16.95 64.15,23.9 28.3,51 28.25,49.35 36.5,50.05 61.15,57
  pour Bottom: 8,60 72,60 72,53 arc90 73,52 80,52 80,8 73,8 arc90 72,7 72,0 0,0 0,52 7,52 arc90 8,53
  pour Top: 0,12 11,12 11,19 40,19 40,0 0.32,0 arc-90 0,0.32
  pour Top (isolate 0.61): 0,52 7,52 arc90 8,53 50,53 50,26 0,26
  pour Top: 42,20 48,20 48,16 42,16
  pour Top: 65,16 57,16 57,28 58,29 61,29 61,27 62,26 62,25 65,25
  pour Top: 68,46 68,31 73,31 75,33 75,46
  pour Top: 63,33 67,33 67,30 64,30 63,31
  pour Top: 59,55 59,59 62,59 62,55
M_RESETBEACON  (via drill 0.6)
  Top 0.254: U6.3 46.85,18.6 v46.85,17.35
  Bottom 0.254: v46.85,17.35 45.5,15.7 12.35,15.7 9.3,17.7 6.6,17.7 6.62,17.72 X1.5
N$1
  Top 0.254: R3.2 66.53,49.45 LED1.A
N$2
  Top 0.254: U4.17 64.75,47.75 64.95,47.95 | R3.1 64.95,47.95 | 64.95,47.95 65,48
N$3
  Top 0.254: U2.5 U2.5 arc45 62.25,23.79 C4.1 R4.1 R12.2
N$6
  Top 0.254: R11.2 R2.1 C2.1 58.25,23.9 59.02,24.68 U2.3
N$7
  Top 0.254: U4.8 67.82,39.75 arc-45 68.04,39.66 68.86,38.84 arc45 69.08,38.75 Q1.1 71.07,38.75 arc45 71.29,38.84 C11.1
N$8
  Top 0.254: U4.9 67.77,40.25 arc45 67.99,40.34 68.81,41.16 arc-45 69.03,41.25 Q1.2 71.07,41.25 arc-45 71.29,41.16 C12.1
N$11  (via drill 0.5)
  Top 0.254: U4.54 59.75,33.43 arc-72 59.53,33.13 v56.95,32.3 | v70.7,22.1 70.7,11.7 68,9 53.15,9 52.4,8.25 52.4,6.1 51.7,5.65 49.35,5.65 48.45,4.5 48.41,4.5 X2.1
  Bottom 0.254: v56.95,32.3 56.95,31.1 58.6,29.45 63.1,29.45 v70.7,22.1
N$12
  Top 0.254: C9.1 68.24,35.57 arc-45 68.15,35.79 68.15,38.62 arc45 68.06,38.84 67.74,39.16 arc45 67.52,39.25 U4.7
N$14  (via drill 0.5)
  Top 0.254: U4.55 60.25,33.14 arc-62 60.08,32.86 v58.15,31.85 | v71.5,23.2 71.5,11.55 68.35,8.4 55.5,8.4 54.75,7.65 54.75,6.5 51.5,4.55 51,4.55 50.95,4.5 X2.3
  Bottom 0.254: v58.15,31.85 58.15,30.85 59.05,30.1 63.2,30.1 v71.5,23.2
N$15  (via drill 0.5)
  Top 0.254: U4.56 60.75,32.9 arc-50 60.64,32.66 v59.15,31.4 | v71,25 72.4,23.6 72.4,11.5 66.9,6.05 55.2,6.05 53.65,4.7 53.55,4.57 X2.5
  Bottom 0.254: v59.15,31.4 59.15,30.9 59.4,30.65 63.25,30.65 v71,25
N$16  (via drill 0.5)
  Top 0.254: U4.57 61.25,32.52 arc-42 61.17,32.31 v60.35,31.4 | v71.05,26.25 73,24.3 73,11.25 67.25,5.55 57,5.55 56,4.5 56.02,4.5 | 56.05,4.5 56.02,4.5 | 56.02,4.5 X2.7
  Bottom 0.254: v60.35,31.4 63.25,31.4 v71.05,26.25
N$19
  Top 0.254: U1.17 33.97,33.07 arc45 TP6.TP
N$21
  Top 0.254: X2.11 61.08,4.08 60,3 43,3 42,4 42,5.2 R7.1
N$23
  Top 0.254: U1.23 36.97,33.48 arc-45 36.88,33.25 TP7.TP
N$42
  Top 0.61: C7.- L7.1 19.23,40.97 arc-45 19.32,41.19 C54.1
N$43
  Top 0.61: L8.1 L7.2 17.73,40.97 arc45 17.64,41.19 C55.1
N$44
  Top 0.254: 14.55,41.37 arc-45 14.65,41.6 C56.1
  Top 0.61: L8.2 14.55,41.37
  Top 0.889: L8.2 X4.1
N$45
  Top 0.254: C62.1 28.55,46.09 arc45 28.78,46 29,46 31.91,43.09 arc-45 32,42.87 32,42.1 | 32,42 32,42.05 | 32,42.05 32,42.1 | 32,42.1 31.95,42.05 32,42.05 | 32,42.05 U1.48 arc45 U1.48
N$46
  Top 0.254: C63.2 24.37,49.34 arc-45 24.46,49.56 R21.2
N$47
  Top 0.254: U1.31 41,39 41.47,38.53 arc45 41.69,38.44 C60.1
N$48
  Top 0.254: C67.1 29.47,34.94 arc-45 29.66,35.31 30.95,36.5 U1.11 31.45,36.5
N$49  (via drill 0.5 pad 0.3)
  Top 0.254: U1.10 30.53,37 arc45 30.21,36.91 v30,36.7 | v25.05,34.75 R20.2
  Bottom 0.254: v30,36.7 29.83,36.7 arc45 29.61,36.61 27.75,34.75 v25.05,34.75
N$50  (via drill 0.5 pad 0.3)
  Top 0.254: U1.8 30.58,38 arc-45 30.36,38.09 v29.85,38.6 | v25.95,36.5 23.55,36.5 arc-45 R19.2
  Bottom 0.254: v29.85,38.6 28.18,38.6 arc45 27.96,38.51 v25.95,36.5
N$51
  Top 0.254: U1.41 35.47,44.34 arc-45 35.56,44.56 37,46 37,46.54 arc45 36.91,46.76 C58.1
N$52
  Top 0.254: C63.1 26.91,47.14 arc-45 27,46.92 27,45.53 arc45 27.09,45.31 27.36,45.04 arc45 27.58,44.95 C62.2 | 28.25,44.95 C62.2 | U1.2 30.73,41 arc-45 30.51,41.09 28.24,43.36 arc-45 28.15,43.58 28.15,44.78 arc-45 28.2,44.9 arc-45 28.2,44.91 C62.2
N$53
  Top 0.254: R23.1 C69.1
N$54
  Top 0.254: U1.46 arc-45 32.95,42.1 32.95,43.07 arc45 32.86,43.29 32.29,44.16 arc-45 32.2,44.38 32.2,44.45 | 32.2,44.5 32.2,44.45 | 32.2,44.45 32.15,44.5 L9.1
N$55
  Top 0.254: L9.2 33.65,43.48 arc45 33.74,43.26 34,43 34,42.12 arc-45 U1.44
N$58
  Top 0.254: U4.29 58.75,48.27 arc-45 58.84,48.49 R24.2
N$59
  Top 0.254: U4.31 57.75,48.41 arc45 57.66,48.63 R25.2
N$69
  Top 0.254: 41.13,47.93 arc45 41.3,48 41.3,48 arc-45 TCXO1.3
  Top 0.305: C77.1 41.3,45.57 41.3,48 41.25,47.95 41.15,47.95 41.13,47.93
RESETBEACON  (via drill 0.5)
  Top 0.254: U6.4 46.95,21.85 | 46.95,21.85 46.95,22.67 arc45 46.86,22.89 R1.1 | R1.1 53.56,29.81 arc-45 53.83,29.9 60.05,29.9 61.75,31.7 U4.58 | R1.1 46.91,23.16 arc45 47,23.38 TP3.TP | R7.2 42.05,8.05 43,9 49,9 49.7,10.05 v49.7,13 | v49,21 49,21.35 48.55,21.8 47,21.8 46.95,21.85
  Bottom 0.254: v49.7,13 52,16 52,18 v49,21
VBUSBEACON
  Top 0.305: C13.1 arc45 16,20.89 16,21.3 | U11.1 18.19,21.21 arc45 17.97,21.3 17.9,21.3
  Top 1.27: C8.1 13.09,21.36 arc-45 13,21.58 TP1.TP | C8.1 11.25,21.3 10.29,20.34 arc-45 10.07,20.25 X1.4 | C8.1 16,21.3 17.9,21.3

### Text on the board
Top: OSSI Beacon
tPlace: R | T | G | T1 | T2 | VBUS | 3.3v | RST | ADC0 | ADC1 | MR | SDA | SCL | GND
tStop: OSSI Beacon